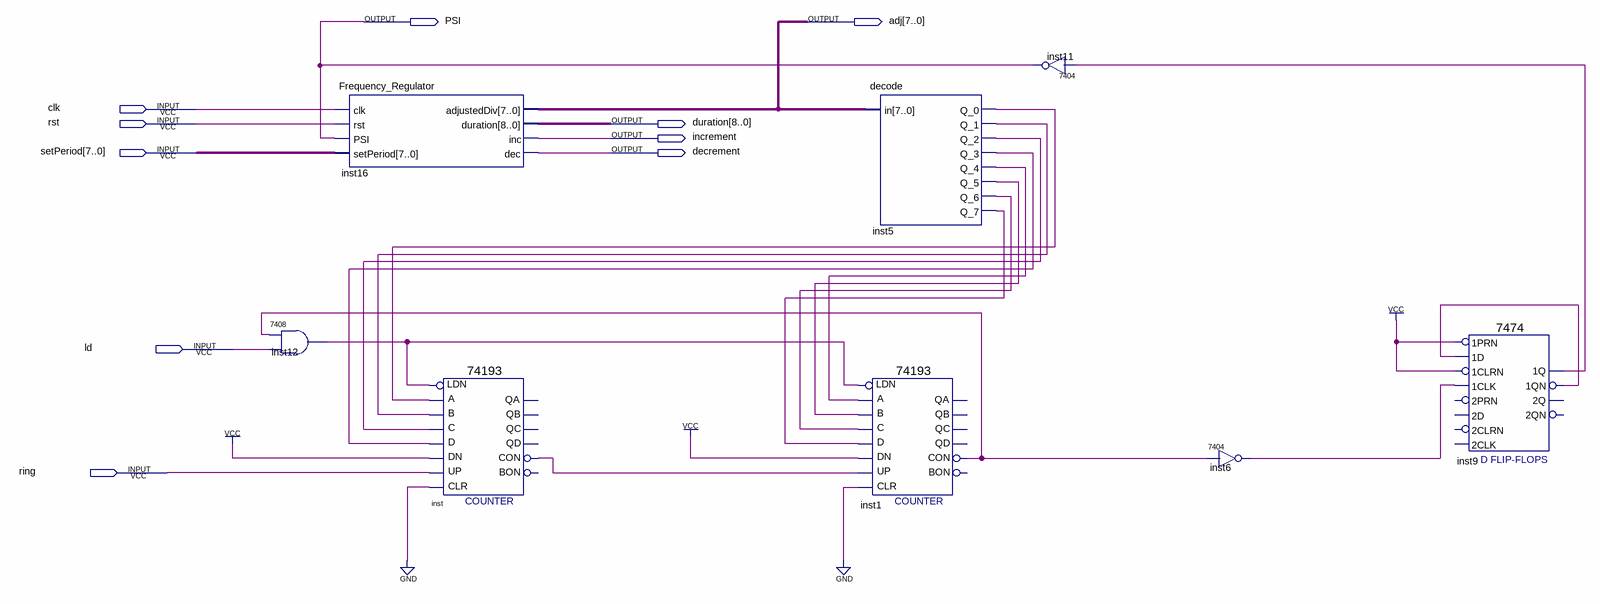
[diagram p0: schematic sheet]
// Quartus schematic Clock_adjusting.bdf as structural Verilog: 8 symbols, 10 pins
module Clock_adjusting (
  input  clk,
  input  rst,
  input  [7:0] setPeriod,
  input  ld,
  input  ring,
  output PSI,
  output [7:0] adj,
  output [8:0] duration,
  output increment,
  output decrement
);

  wire inst1_con, inst5_q_0, inst5_q_1, inst5_q_2, inst5_q_3, inst5_q_4, inst5_q_5, inst5_q_6, inst5_q_7,
       inst6_1, inst9_1q, inst9_1qn, inst12_1, inst_con;

  \7408  inst12 (.\3 (ld), .\2 (inst1_con), .\1 (inst12_1));
  Frequency_Regulator inst16 (
    .clk(clk), .rst(rst), .PSI(PSI), .setPeriod(setPeriod), .adjustedDiv(adj), .duration(duration),
    .inc(increment), .dec(decrement));
  \74193  inst (
    .D(inst5_q_3), .C(inst5_q_2), .B(inst5_q_1), .A(inst5_q_0), .CLR(1'b0), .UP(ring), .DN(1'b1),
    .LDN(inst12_1), .CON(inst_con));  // open: QB, QA, QD, QC, BON
  decode inst5 (
    .in(adj), .Q_0(inst5_q_0), .Q_1(inst5_q_1), .Q_2(inst5_q_2), .Q_3(inst5_q_3), .Q_4(inst5_q_4),
    .Q_5(inst5_q_5), .Q_6(inst5_q_6), .Q_7(inst5_q_7));
  \74193  inst1 (
    .D(inst5_q_7), .C(inst5_q_6), .B(inst5_q_5), .A(inst5_q_4), .CLR(1'b0), .UP(inst_con), .DN(1'b1),
    .LDN(inst12_1), .CON(inst1_con));  // open: QB, QA, QD, QC, BON
  \7404  inst11 (.\2 (inst9_1q), .\1 (PSI));
  \7404  inst6 (.\2 (inst1_con), .\1 (inst6_1));
  \7474  inst9 (
    .\1CLK (inst6_1), .\1D (inst9_1qn), .\1PRN (1'b1), .\1CLRN (1'b1), .\1QN (inst9_1qn), .\1Q (inst9_1q));  // open: 2D, 2PRN, 2CLK, 2CLRN, 2Q, 2QN
endmodule
